# EAGLE design version_0_test (EAGLE 8.3.1)
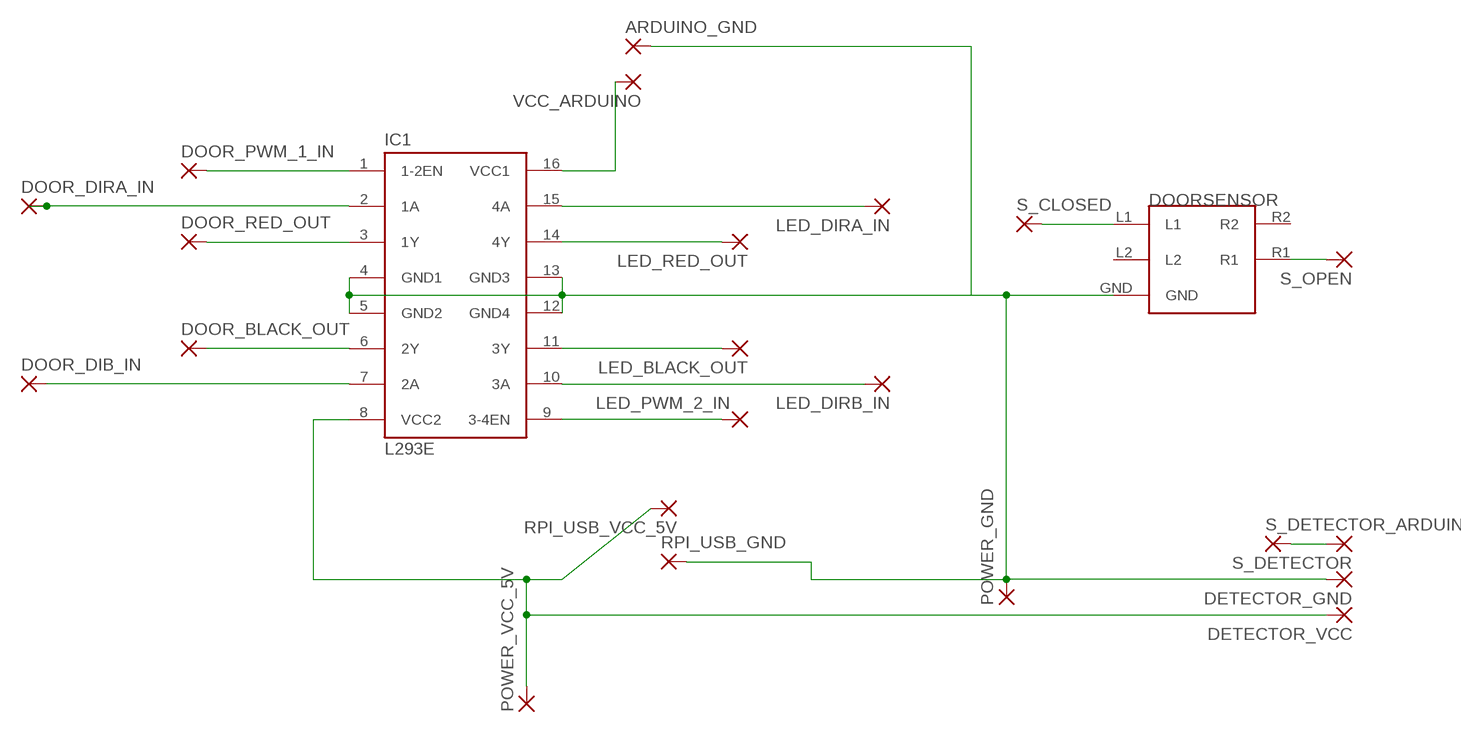
[diagram p0: schematic, sheet 1]

## Parts
ARDUINO_GND  SMD5  [SMD2,54-5,08]
DETECTOR_GND  SMD5  [SMD2,54-5,08]
DETECTOR_VCC  SMD5  [SMD2,54-5,08]
DOOR_BLACK_OUT  SMD5  [SMD2,54-5,08]
DOOR_DIB_IN  SMD5  [SMD2,54-5,08]
DOOR_DIRA_IN  SMD5  [SMD2,54-5,08]
DOOR_PWM_1_IN  SMD5  [SMD2,54-5,08]
DOOR_RED_OUT  SMD5  [SMD2,54-5,08]
DOORSENSOR  DOORSENSOR  [DOORSENSOR]
IC1  L293E  [DIL16]
LED_BLACK_OUT  SMD5  [SMD2,54-5,08]
LED_DIRA_IN  SMD5  [SMD2,54-5,08]
LED_DIRB_IN  SMD5  [SMD2,54-5,08]
LED_PWM_2_IN  SMD5  [SMD2,54-5,08]
LED_RED_OUT  SMD5  [SMD2,54-5,08]
POWER_GND  SMD5  [SMD2,54-5,08]
POWER_VCC_5V  SMD5  [SMD2,54-5,08]
RPI_USB_GND  SMD5  [SMD2,54-5,08]
RPI_USB_VCC_5V  SMD5  [SMD2,54-5,08]
S_CLOSED  SMD5  [SMD2,54-5,08]
S_DETECTOR  SMD5  [SMD2,54-5,08]
S_DETECTOR_ARDUINO  SMD5  [SMD2,54-5,08]
S_OPEN  SMD5  [SMD2,54-5,08]
VCC_ARDUINO  SMD5  [SMD2,54-5,08]

## Nets
GND: ARDUINO_GND.1(P) DETECTOR_GND.1(P) DOORSENSOR.GND IC1.4(GND1) IC1.5(GND2) IC1.12(GND4) IC1.13(GND3) POWER_GND.1(P) RPI_USB_GND.1(P)
N$2: S_DETECTOR.1(P) S_DETECTOR_ARDUINO.1(P)
N$3: DOORSENSOR.L1 S_CLOSED.1(P)
N$4: DOORSENSOR.R1 S_OPEN.1(P)
N$5: DOOR_BLACK_OUT.1(P) IC1.6(2Y)
N$6: DOOR_RED_OUT.1(P) IC1.3(1Y)
N$7: IC1.9(3-4EN) LED_PWM_2_IN.1(P)
N$8: DOOR_PWM_1_IN.1(P) IC1.1(1-2EN)
N$9: DOOR_DIRA_IN.1(P) IC1.2(1A)
N$10: DOOR_DIB_IN.1(P) IC1.7(2A)
N$11: IC1.10(3A) LED_DIRB_IN.1(P)
N$12: IC1.15(4A) LED_DIRA_IN.1(P)
N$13: IC1.11(3Y) LED_BLACK_OUT.1(P)
N$14: IC1.14(4Y) LED_RED_OUT.1(P)
VCC_ARDUINO: IC1.16(VCC1) VCC_ARDUINO.1(P)
VCC_MOTOR: DETECTOR_VCC.1(P) IC1.8(VCC2) POWER_VCC_5V.1(P) RPI_USB_VCC_5V.1(P)
Unconnected: DOORSENSOR.L2 DOORSENSOR.R2

## Library data of the parts
ARDUINO_GND DETECTOR_GND DETECTOR_VCC DOOR_BLACK_OUT DOOR_DIB_IN DOOR_DIRA_IN DOOR_PWM_1_IN DOOR_RED_OUT LED_BLACK_OUT LED_DIRA_IN LED_DIRB_IN LED_PWM_2_IN LED_RED_OUT POWER_GND POWER_VCC_5V RPI_USB_GND RPI_USB_VCC_5V S_CLOSED S_DETECTOR S_DETECTOR_ARDUINO S_OPEN VCC_ARDUINO = wirepad:SMD5: SMD PAD
DOORSENSOR = custom_components:DOORSENSOR
IC1 = texas:L293E: TI DEVICE; MF: Arrow Electronics; MPN: L293E; OC_FARNELL: 1467711; OC_NEWARK: 89K0732

## Board
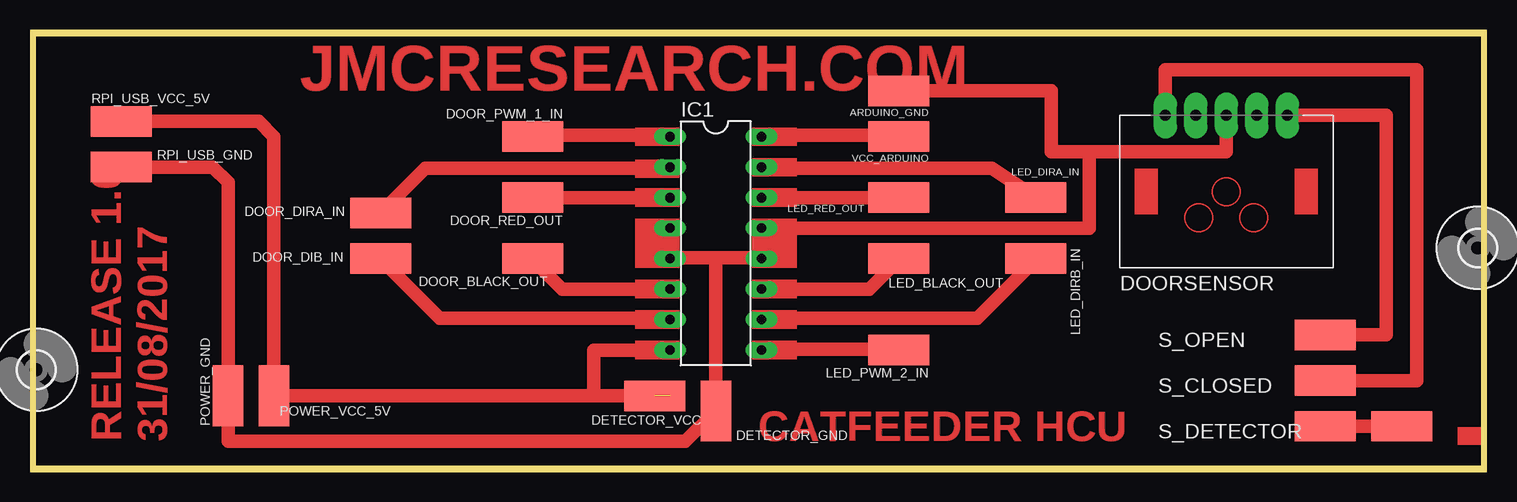
[diagram p1: board, top side]

Size 121.41 x 36.83 mm. Coordinates in mm from the lower left corner, seen from the top.
Outline: 0,0 121.41,0 121.41,36.83 0,36.83 0,0
Copper layers (1*16): Top 0.035mm / dielectric 1.5mm / Bottom 0.035mm
Design rules "default": minimum track width 6mil, minimum drill 0.35mm, track to track 6mil, track to pad 6mil, pad to pad 6mil, via to via 6mil, smd to smd 6mil, copper to edge 40mil, drill to drill 6mil, minimum pad ring 10mil, minimum via ring 8mil, stop-mask expansion 4mil, vias tented up to drill 0mil, thermal gap 10mil
Milling: 4 lines

### Footprints (pad centres in the part's own frame; a part is rotated, then mirrored left to right if it is on the bottom)
SMD2,54-5,08 = smd 2.54 x 5.08: 1 0,0
DOORSENSOR = drill 0.9 pad 1.93 long: GND 0,6.35; L1 -5.08,6.35; L2 -2.54,6.35; R1 5.08,6.35; R2 2.54,6.35
DIL16 = drill 0.813 long: 1 -8.89,-3.81; 2 -6.35,-3.81; 3 -3.81,-3.81; 4 -1.27,-3.81; 5 1.27,-3.81; 6 3.81,-3.81; 7 6.35,-3.81; 8 8.89,-3.81; 9 8.89,3.81; 10 6.35,3.81; 11 3.81,3.81; 12 1.27,3.81; 13 -1.27,3.81; 14 -3.81,3.81; 15 -6.35,3.81; 16 -8.89,3.81
3,0 = hole 3: 0,0

### Placement (x,y rotation side)
ARDUINO_GND  72.39,31.75 90 top
DETECTOR_GND  57.15,5.08 180 top
DETECTOR_VCC  52.07,6.35 270 top
DOOR_BLACK_OUT  41.91,17.78 90 top
DOOR_DIB_IN  29.21,17.78 90 top
DOOR_DIRA_IN  29.21,21.59 90 top
DOOR_PWM_1_IN  41.91,27.94 90 top
DOOR_RED_OUT  41.91,22.86 90 top
DOORSENSOR  99.69,23.37 0 top
IC1  57.15,19.05 270 top
LED_BLACK_OUT  72.39,17.78 90 top
LED_DIRA_IN  83.82,22.86 90 top
LED_DIRB_IN  83.82,17.78 90 top
LED_PWM_2_IN  72.39,10.16 90 top
LED_RED_OUT  72.39,22.86 90 top
POWER_GND  16.51,6.35 0 top
POWER_VCC_5V  20.32,6.35 0 top
RPI_USB_GND  7.62,25.4 270 top
RPI_USB_VCC_5V  7.62,29.21 270 top
S_CLOSED  107.95,7.62 270 top
S_DETECTOR  107.95,3.81 270 top
S_DETECTOR_ARDUINO  114.3,3.81 90 top
S_OPEN  107.95,11.43 270 top
U$1  [3,0]  120.65,18.67 0 top
U$2  [3,0]  0.51,8.51 0 top
VCC_ARDUINO  72.39,27.94 90 top

### Tracks (layer width: path | path; a pad name or v marks a point on that pad's centre or on a via)
GND
  Top 1.143: IC1.4 53.34,17.83 | 60.96,17.83 IC1.13 88.27,20.32 88.27,26.67 | 57.44,17.83 60.96,17.83 | 57.44,17.83 53.34,17.83 | 53.34,17.83 IC1.5 | 60.96,17.83 IC1.12 | 88.27,26.67 99.69,26.67 DOORSENSOR.GND | 88.27,26.67 85.09,26.67 85.09,31.75 ARDUINO_GND.1 | 57.44,17.83 57.15,17.54 DETECTOR_GND.1 54.61,2.54 16.51,2.54 POWER_GND.1 16.51,24.13 15.24,25.4 RPI_USB_GND.1
N$2
  Top 1.143: S_DETECTOR_ARDUINO.1 S_DETECTOR.1
N$3
  Top 1.143: DOORSENSOR.L1 94.67,29.72 94.61,29.64 DOORSENSOR.L1 | DOORSENSOR.L1 94.61,33.53 115.57,33.53 115.57,7.62 S_CLOSED.1
N$4
  Top 1.143: 104.34,29.72 DOORSENSOR.R1 113.03,29.72 113.03,11.43 S_OPEN.1
N$5
  Top 1.143: IC1.6 44.35,15.24 41.91,17.68 DOOR_BLACK_OUT.1
N$6
  Top 1.143: IC1.3 43.13,22.86 41.91,22.91 DOOR_RED_OUT.1
N$7
  Top 1.143: IC1.9 60.96,10.21 72.39,10.21 LED_PWM_2_IN.1
N$8
  Top 1.143: IC1.1 53.34,28.04 41.91,28.04 DOOR_PWM_1_IN.1
N$9
  Top 1.143: DOOR_DIRA_IN.1 32.92,25.3 53.34,25.3 IC1.2
N$10
  Top 1.143: IC1.7 53.34,12.8 34.14,12.8 29.26,17.68 DOOR_DIB_IN.1
N$11
  Top 1.143: IC1.10 60.96,12.8 78.94,12.8 83.82,17.68 LED_DIRB_IN.1
N$12
  Top 1.143: IC1.15 60.96,25.3 80.16,25.3 83.82,22.91 LED_DIRA_IN.1
N$13
  Top 1.143: IC1.11 69.95,15.24 72.39,17.68 LED_BLACK_OUT.1
N$14
  Top 1.143: IC1.14 71.17,22.86 72.39,22.91 LED_RED_OUT.1
VCC_ARDUINO
  Top 1.143: IC1.16 60.96,28.04 72.39,28.04 VCC_ARDUINO.1
VCC_MOTOR  (1 unrouted)
  Top 1.143: RPI_USB_VCC_5V.1 19.05,29.21 20.32,27.94 POWER_VCC_5V.1 47.17,6.35 | 47.17,6.35 53.34,6.35 | IC1.8 46.99,10.16 46.99,6.53 47.17,6.35
(copper drawn outside any net)
  shapes: Top area x20

### Text on the board
Top: JMCRESEARCH.COM | CATFEEDER HCU | RELEASE 1.0 / 31/08/2017